# Altium schematic sheet altium.schdoc
size 148 x 79 mm
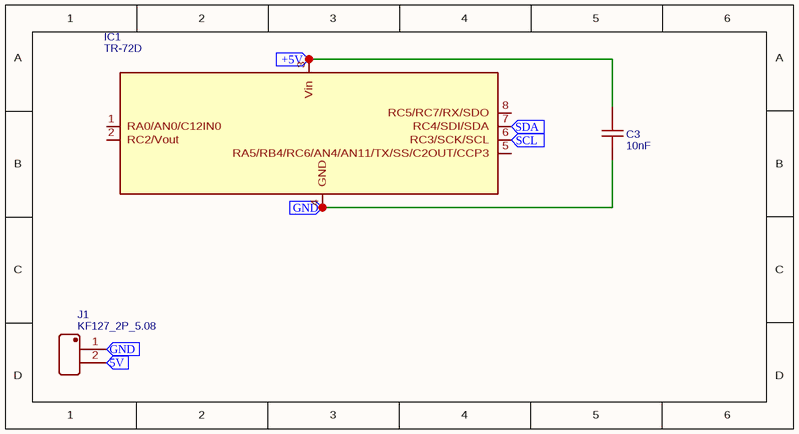
[diagram p0: altium.schdoc]

## Parts
C3  10nF  [0603]
IC1  TR-72D  [IQRF_KON-SIM-01]
J1  KF127_2P_5.08  [KF127_2P_5.08]

## Ports
5V, +5V, GND, SCL, SDA

## Nets
5V: J1.2(PIN2) ; port 5V
+5V: C3.2 IC1.3(Vin) ; port +5V
GND: C3.1 IC1.4(GND) J1.1(PIN1) ; port GND
SCL: IC1.6(RC3/SCK/SCL) ; port SCL
SDA: IC1.7(RC4/SDI/SDA) ; port SDA

Not connected (* = marked no-connect by the designer): IC1 1(RA0/AN0/C12IN0) 2(RC2/Vout) 5(RA5/RB4/RC6/AN4/AN11/TX/SS/C2OUT/CCP3) 8(RC5/RC7/RX/SDO)

## Library data of the parts
C3 = 10nF: BOM_Manufacturer: Guangdong Fenghua Advanced Tech; BOM_Manufacturer Part: 0603B103K500AT; nameAlias: Capacitance; Contributor: LCSC; BOM_Supplier: LCSC; BOM_Supplier Part: C327421; spicePre: C; spiceSymbolName: 0603B103K500AT
IC1 = TR-72D: Contributor: Simen Stensas; license: https://www.gnu.org/licenses/lgpl-2.1.html; spicePre: I
J1 = KF127_2P_5.08: BOM_Manufacturer: Kefa Electronics; BOM_Manufacturer Part: KF127L-5.08; Contributor: GrahamG; spicePre: J